# Altium schematic sheet motordriver.SchDoc
size A
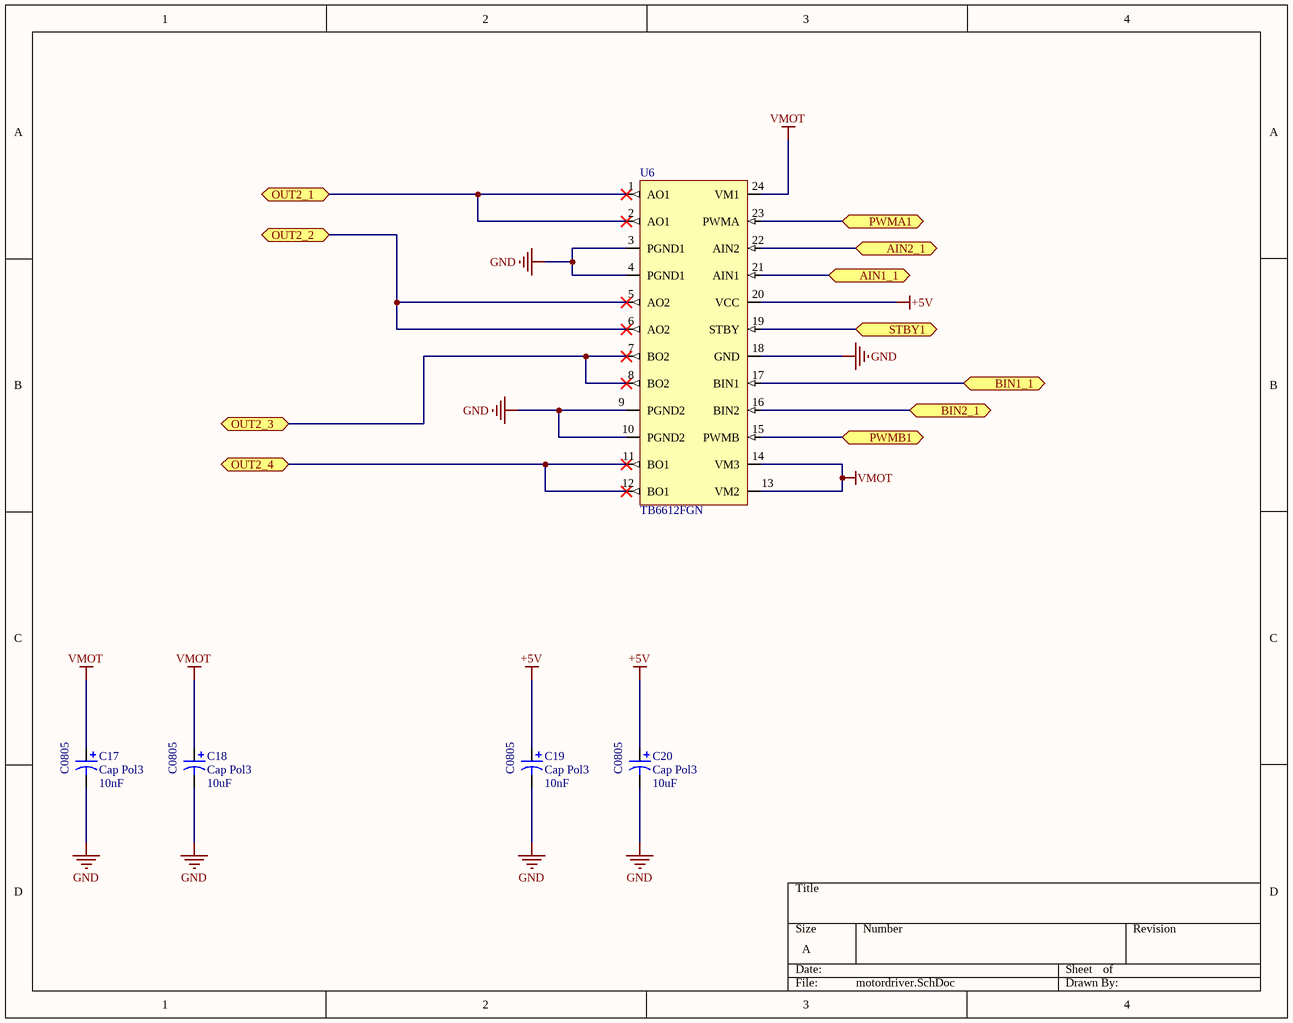
[diagram p0: motordriver.SchDoc]

## Parts
C17  Cap Pol3  value 10nF  [C0805]
C18  Cap Pol3  value 10uF  [C0805]
C19  Cap Pol3  value 10nF  [C0805]
C20  Cap Pol3  value 10uF  [C0805]
U6  TB6612FGN  [TBS6612FNG]

## Ports
AIN1_1, AIN2_1, BIN1_1, BIN2_1, OUT2_1, OUT2_2, OUT2_3, OUT2_4, PWMA1, PWMB1, STBY1

## Nets
+5V: C19.1 C20.1 U6.20(VCC)
GND: C17.2 C18.2 C19.2 C20.2 U6.3(PGND1) U6.4(PGND1) U6.9(PGND2) U6.10(PGND2) U6.18(GND)
VMOT: C17.1 C18.1 U6.13(VM2) U6.14(VM3) U6.24(VM1)
AIN1_1: U6.21(AIN1) ; port AIN1_1
AIN2_1: U6.22(AIN2) ; port AIN2_1
BIN1_1: U6.17(BIN1) ; port BIN1_1
BIN2_1: U6.16(BIN2) ; port BIN2_1
OUT2_1: U6.1(AO1) U6.2(AO1) ; port OUT2_1
OUT2_2: U6.5(AO2) U6.6(AO2) ; port OUT2_2
OUT2_3: U6.7(BO2) U6.8(BO2) ; port OUT2_3
OUT2_4: U6.11(BO1) U6.12(BO1) ; port OUT2_4
PWMA1: U6.23(PWMA) ; port PWMA1
PWMB1: U6.15(PWMB) ; port PWMB1
STBY1: U6.19(STBY) ; port STBY1

## Library data of the parts
C17-C20 = Cap Pol3: Polarized Capacitor (Surface Mount); Published: 8-Jun-2000; LatestRevisionDate: 29-May-2009; LatestRevisionNote: IPC-7351 Footprint Added.; PackageReference: C0805; Publisher: Altium Limited; PackageDescription: Chip Capacitor